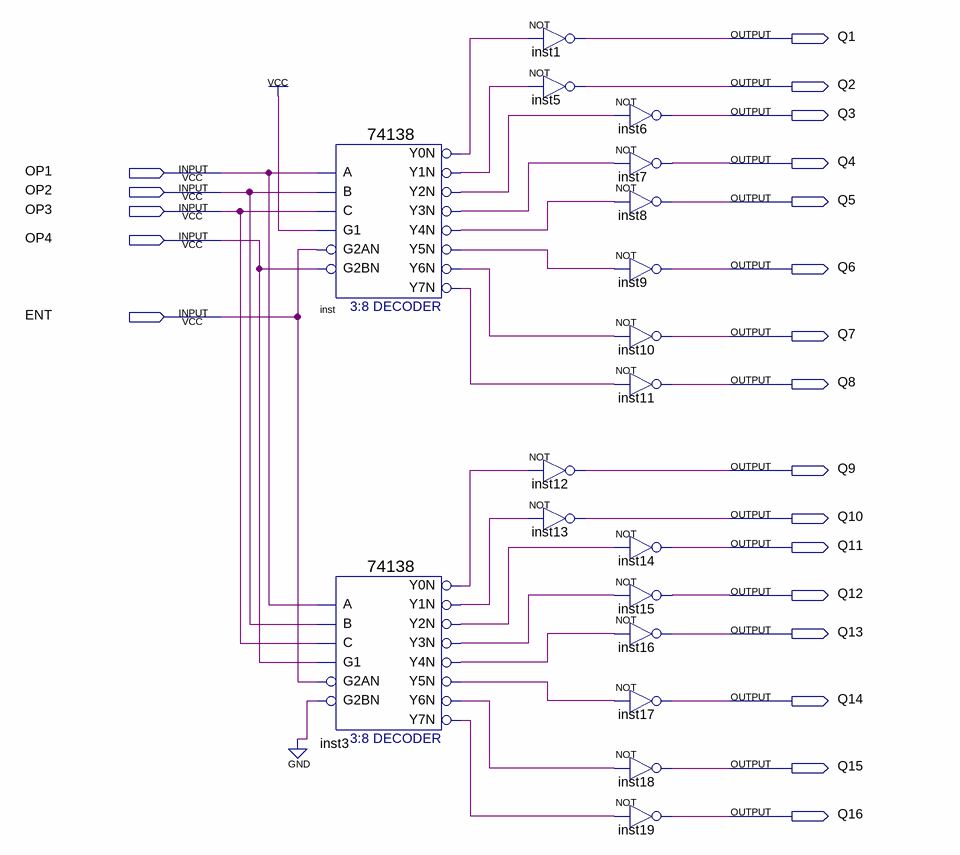
[diagram p0: schematic sheet]
// Quartus schematic IR.bdf as structural Verilog: 18 symbols, 21 pins
module IR (
  input  OP1,
  input  OP2,
  input  OP3,
  input  OP4,
  input  ENT,
  output Q1,
  output Q2,
  output Q3,
  output Q4,
  output Q5,
  output Q6,
  output Q7,
  output Q8,
  output Q9,
  output Q10,
  output Q11,
  output Q12,
  output Q13,
  output Q14,
  output Q15,
  output Q16
);

  wire inst3_y0n, inst3_y1n, inst3_y2n, inst3_y3n, inst3_y4n, inst3_y5n, inst3_y6n, inst3_y7n, inst_y0n,
       inst_y1n, inst_y2n, inst_y3n, inst_y4n, inst_y5n, inst_y6n, inst_y7n;

  \74138  inst (
    .A(OP1), .B(OP2), .G1(1'b1), .C(OP3), .G2AN(ENT), .G2BN(OP4), .Y0N(inst_y0n), .Y1N(inst_y1n),
    .Y2N(inst_y2n), .Y3N(inst_y3n), .Y4N(inst_y4n), .Y5N(inst_y5n), .Y6N(inst_y6n), .Y7N(inst_y7n));
  \74138  inst3 (
    .A(OP1), .B(OP2), .G1(OP4), .C(OP3), .G2AN(ENT), .G2BN(1'b0), .Y0N(inst3_y0n), .Y1N(inst3_y1n),
    .Y2N(inst3_y2n), .Y3N(inst3_y3n), .Y4N(inst3_y4n), .Y5N(inst3_y5n), .Y6N(inst3_y6n), .Y7N(inst3_y7n));
  not inst1 (Q1, inst_y0n);
  not inst5 (Q2, inst_y1n);
  not inst12 (Q9, inst3_y0n);
  not inst13 (Q10, inst3_y1n);
  not inst6 (Q3, inst_y2n);
  not inst7 (Q4, inst_y3n);
  not inst8 (Q5, inst_y4n);
  not inst9 (Q6, inst_y5n);
  not inst10 (Q7, inst_y6n);
  not inst11 (Q8, inst_y7n);
  not inst14 (Q11, inst3_y2n);
  not inst15 (Q12, inst3_y3n);
  not inst16 (Q13, inst3_y4n);
  not inst17 (Q14, inst3_y5n);
  not inst18 (Q15, inst3_y6n);
  not inst19 (Q16, inst3_y7n);
endmodule
